# Altium schematic sheet Main.SchDoc
size A; SheetNumber: 1; SheetTotal: 1
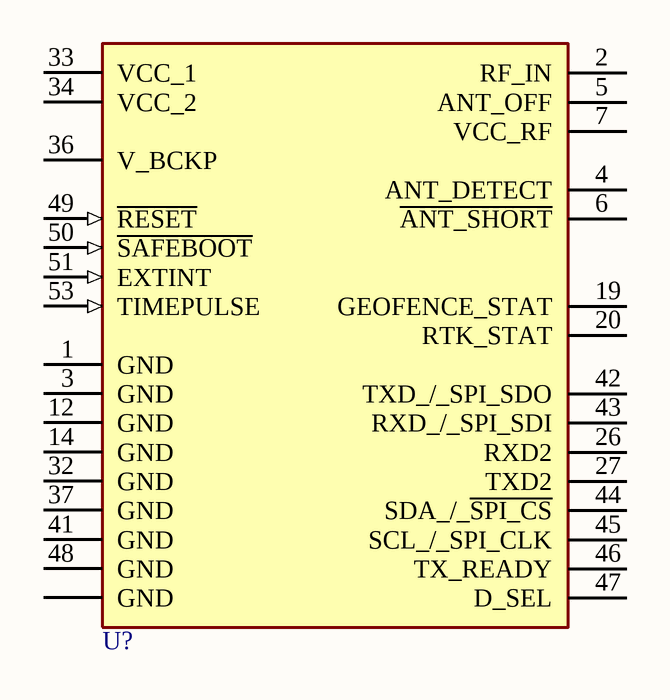
[diagram p0: Main.SchDoc]

## Parts
U?  High-Precision Triple Band GNSS Module  [[GNSS] ZED-F20P-00B]  (value not drawn)

## Nets

Not connected (* = marked no-connect by the designer): U? 1(GND) 2(RF_IN) 3(GND) 4(ANT_DETECT) 5(ANT_OFF) 6(~{ANT_SHORT}) 7(VCC_RF) 12(GND) 14(GND) 19(GEOFENCE_STAT) 20(RTK_STAT) 26(RXD2) 27(TXD2) 32(GND) 33(VCC_1) 34(VCC_2) 36(V_BCKP) 37(GND) 41(GND) 42(TXD_/_SPI_SDO) 43(RXD_/_SPI_SDI) 44(SDA_/_~{SPI_CS}) 45(SCL_/_SPI_CLK) 46(TX_READY) 47(D_SEL) 48(GND) 49(~{RESET}) 50(~{SAFEBOOT}) 51(EXTINT) 53(TIMEPULSE) GND

## Library data of the parts
U? = [GNSS] ZED-F20P-00B: ZED-F20P-00B; Supplier 1: DigiKey; Supplier Part Number 1: 672-ZED-F20P-00BDKR-ND